# EAGLE design adc8 (EAGLE 5.06)
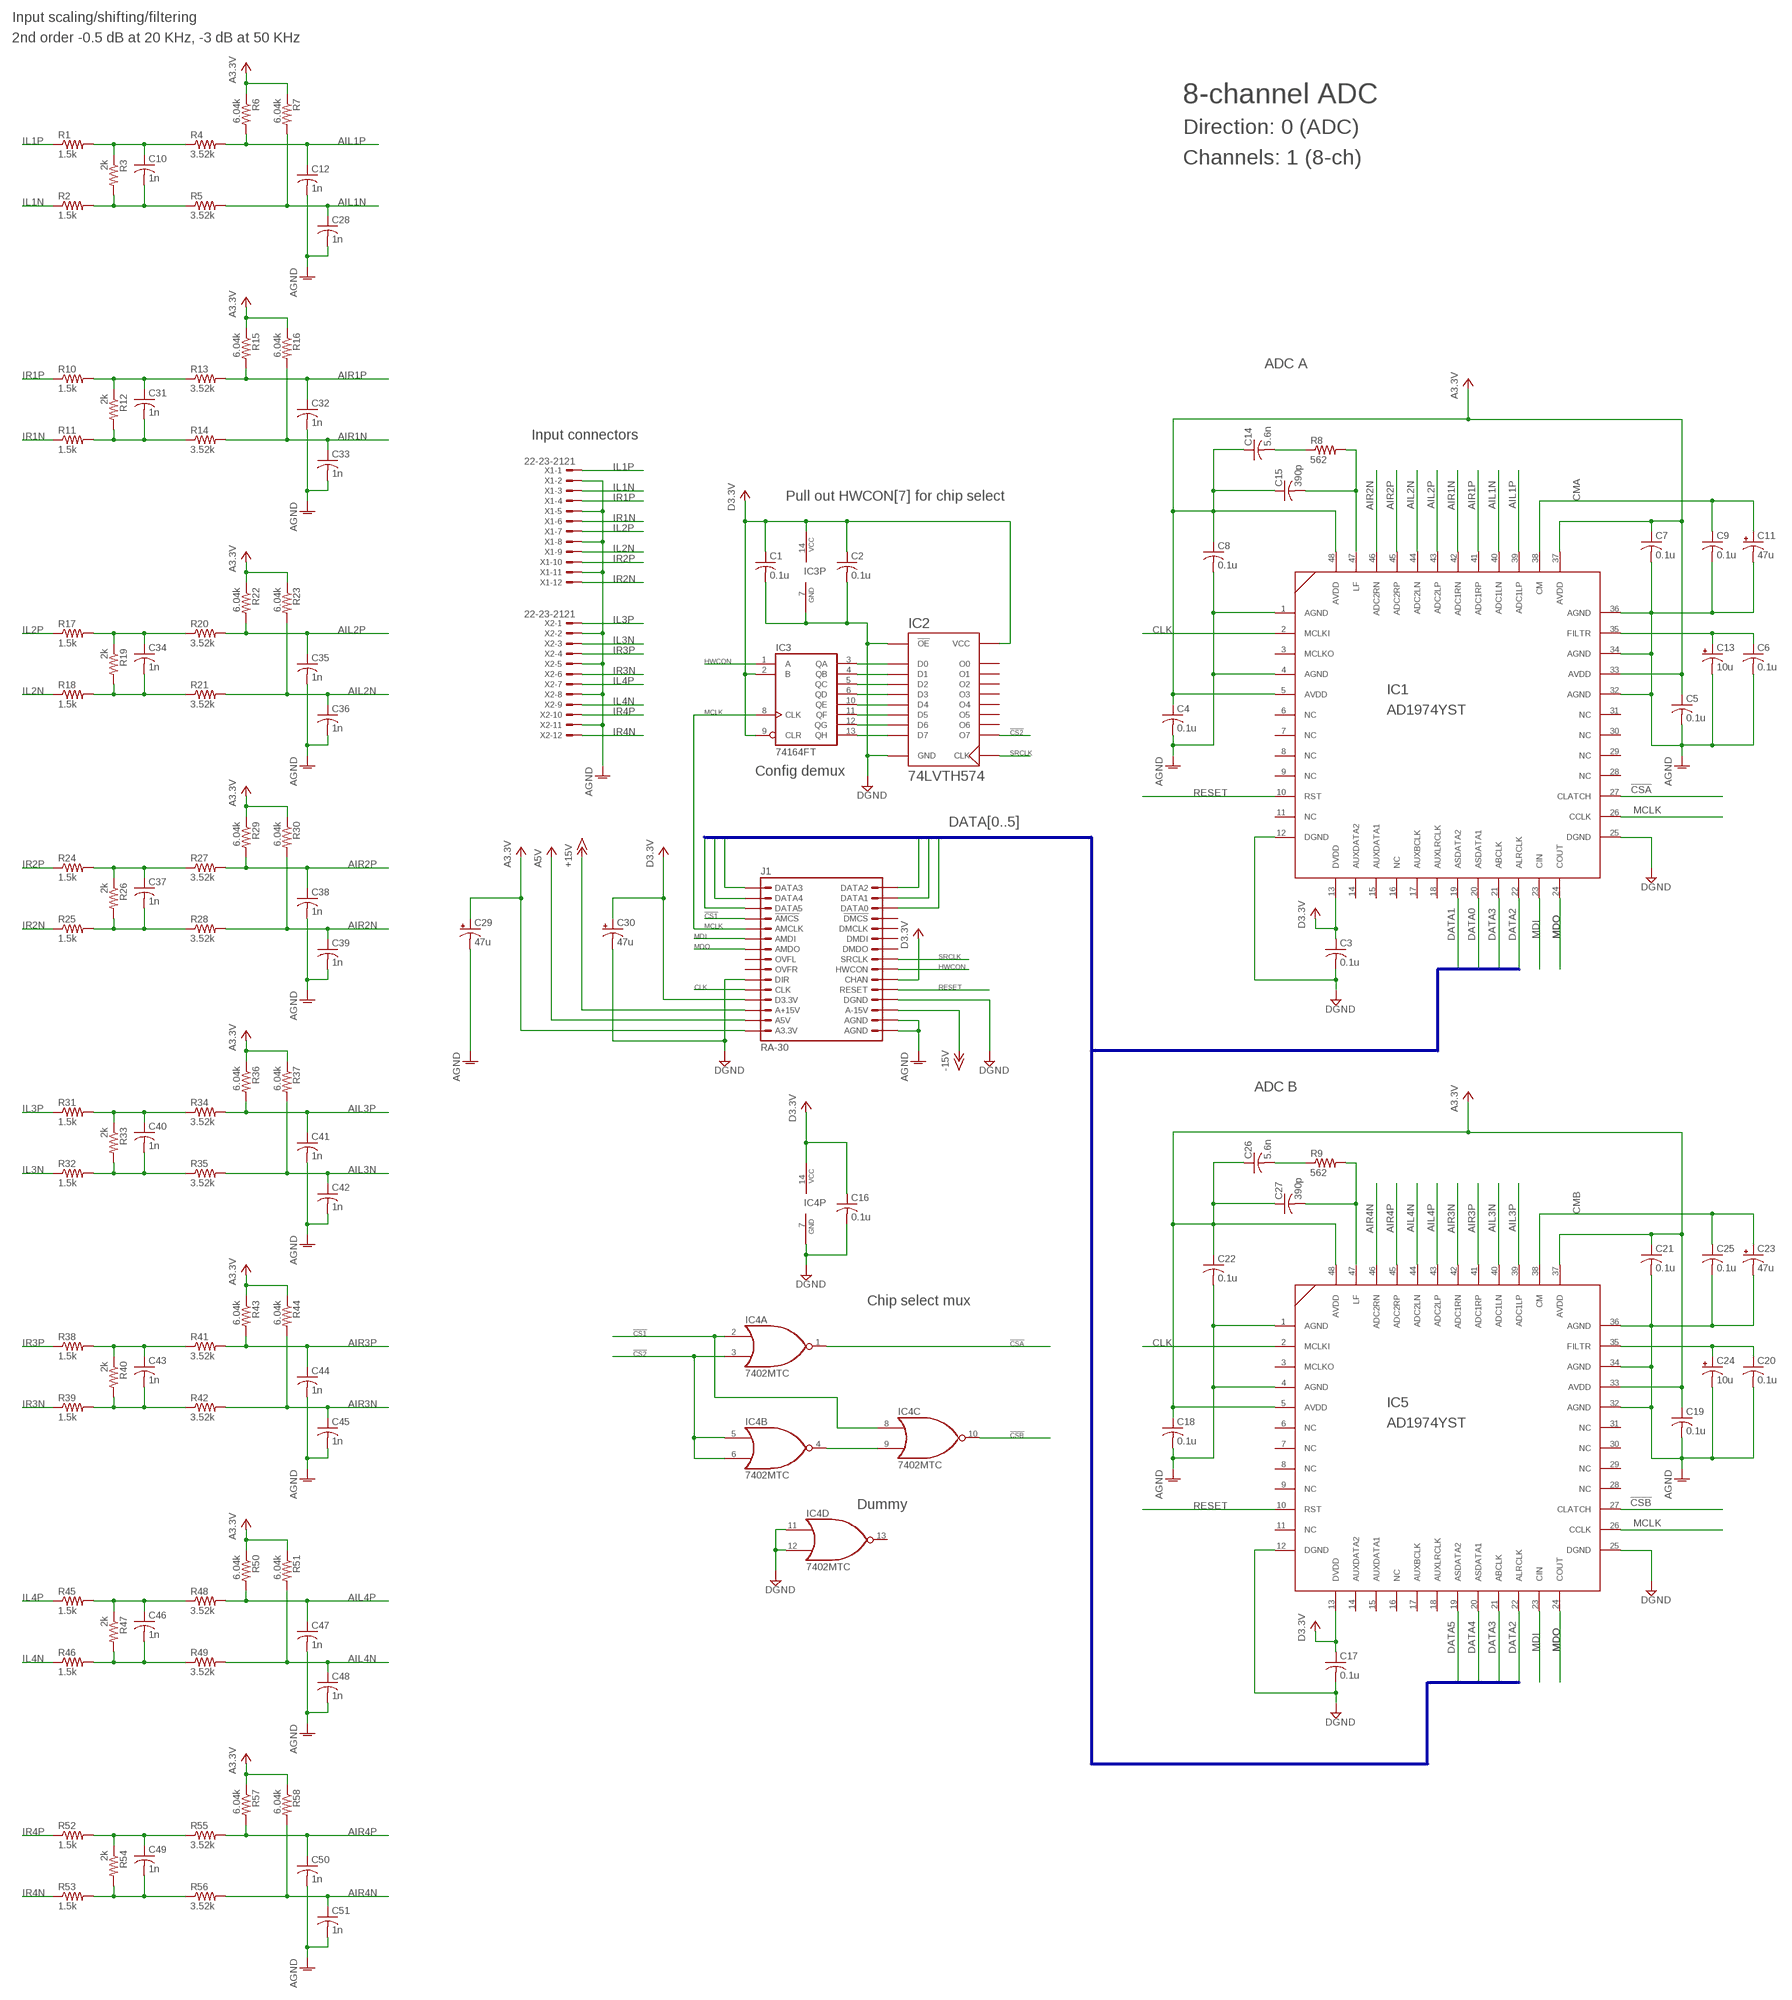
[diagram p0: schematic, sheet 1]

## Parts
C1  0.1u  C-USC1206  [C1206]
C2  0.1u  C-USC1206  [C1206]
C3  0.1u  C-USC1206  [C1206]
C4  0.1u  C-USC1206  [C1206]
C5  0.1u  C-USC1206  [C1206]
C6  0.1u  C-USC1206  [C1206]
C7  0.1u  C-USC1206  [C1206]
C8  0.1u  C-USC1206  [C1206]
C9  0.1u  C-USC1206  [C1206]
C10  1n  C-USC1206  [C1206]
C11  47u  CPOL-USB  [PANASONIC_B]
C12  1n  C-USC1206  [C1206]
C13  10u  CPOL-USA/3216-18R  [A/3216-18R]
C14  5.6n  C-USC1206  [C1206]
C15  390p  C-USC1206  [C1206]
C16  0.1u  C-USC1206  [C1206]
C17  0.1u  C-USC1206  [C1206]
C18  0.1u  C-USC1206  [C1206]
C19  0.1u  C-USC1206  [C1206]
C20  0.1u  C-USC1206  [C1206]
C21  0.1u  C-USC1206  [C1206]
C22  0.1u  C-USC1206  [C1206]
C23  47u  CPOL-USB  [PANASONIC_B]
C24  10u  CPOL-USA/3216-18R  [A/3216-18R]
C25  0.1u  C-USC1206  [C1206]
C26  5.6n  C-USC1206  [C1206]
C27  390p  C-USC1206  [C1206]
C28  1n  C-USC1206  [C1206]
C29  47u  CPOL-USB  [PANASONIC_B]
C30  47u  CPOL-USB  [PANASONIC_B]
C31  1n  C-USC1206  [C1206]
C32  1n  C-USC1206  [C1206]
C33  1n  C-USC1206  [C1206]
C34  1n  C-USC1206  [C1206]
C35  1n  C-USC1206  [C1206]
C36  1n  C-USC1206  [C1206]
C37  1n  C-USC1206  [C1206]
C38  1n  C-USC1206  [C1206]
C39  1n  C-USC1206  [C1206]
C40  1n  C-USC1206  [C1206]
C41  1n  C-USC1206  [C1206]
C42  1n  C-USC1206  [C1206]
C43  1n  C-USC1206  [C1206]
C44  1n  C-USC1206  [C1206]
C45  1n  C-USC1206  [C1206]
C46  1n  C-USC1206  [C1206]
C47  1n  C-USC1206  [C1206]
C48  1n  C-USC1206  [C1206]
C49  1n  C-USC1206  [C1206]
C50  1n  C-USC1206  [C1206]
C51  1n  C-USC1206  [C1206]
IC1  AD1974YST  [LQFP48]
IC2  74LVTH574  [TSSOP20]
IC3  74164FT  [TSSOP14]
IC4  7402MTC  [TSSOP14]
IC5  AD1974YST  [LQFP48]
J1  RA-30  [FCI-RA-30]
R1  1.5k  R-US_R1206  [R1206]
R2  1.5k  R-US_R1206  [R1206]
R3  2k  R-US_R1206  [R1206]
R4  3.52k  R-US_R1206  [R1206]
R5  3.52k  R-US_R1206  [R1206]
R6  6.04k  R-US_R1206  [R1206]
R7  6.04k  R-US_R1206  [R1206]
R8  562  R-US_R1206  [R1206]
R9  562  R-US_R1206  [R1206]
R10  1.5k  R-US_R1206  [R1206]
R11  1.5k  R-US_R1206  [R1206]
R12  2k  R-US_R1206  [R1206]
R13  3.52k  R-US_R1206  [R1206]
R14  3.52k  R-US_R1206  [R1206]
R15  6.04k  R-US_R1206  [R1206]
R16  6.04k  R-US_R1206  [R1206]
R17  1.5k  R-US_R1206  [R1206]
R18  1.5k  R-US_R1206  [R1206]
R19  2k  R-US_R1206  [R1206]
R20  3.52k  R-US_R1206  [R1206]
R21  3.52k  R-US_R1206  [R1206]
R22  6.04k  R-US_R1206  [R1206]
R23  6.04k  R-US_R1206  [R1206]
R24  1.5k  R-US_R1206  [R1206]
R25  1.5k  R-US_R1206  [R1206]
R26  2k  R-US_R1206  [R1206]
R27  3.52k  R-US_R1206  [R1206]
R28  3.52k  R-US_R1206  [R1206]
R29  6.04k  R-US_R1206  [R1206]
R30  6.04k  R-US_R1206  [R1206]
R31  1.5k  R-US_R1206  [R1206]
R32  1.5k  R-US_R1206  [R1206]
R33  2k  R-US_R1206  [R1206]
R34  3.52k  R-US_R1206  [R1206]
R35  3.52k  R-US_R1206  [R1206]
R36  6.04k  R-US_R1206  [R1206]
R37  6.04k  R-US_R1206  [R1206]
R38  1.5k  R-US_R1206  [R1206]
R39  1.5k  R-US_R1206  [R1206]
R40  2k  R-US_R1206  [R1206]
R41  3.52k  R-US_R1206  [R1206]
R42  3.52k  R-US_R1206  [R1206]
R43  6.04k  R-US_R1206  [R1206]
R44  6.04k  R-US_R1206  [R1206]
R45  1.5k  R-US_R1206  [R1206]
R46  1.5k  R-US_R1206  [R1206]
R47  2k  R-US_R1206  [R1206]
R48  3.52k  R-US_R1206  [R1206]
R49  3.52k  R-US_R1206  [R1206]
R50  6.04k  R-US_R1206  [R1206]
R51  6.04k  R-US_R1206  [R1206]
R52  1.5k  R-US_R1206  [R1206]
R53  1.5k  R-US_R1206  [R1206]
R54  2k  R-US_R1206  [R1206]
R55  3.52k  R-US_R1206  [R1206]
R56  3.52k  R-US_R1206  [R1206]
R57  6.04k  R-US_R1206  [R1206]
R58  6.04k  R-US_R1206  [R1206]
X1  22-23-2121  [22-23-2121]
X2  22-23-2121  [22-23-2121]

## Nets
!CS1: IC4.2(A:I0) IC4.8(C:I0) J1.P$A19(!AMCS)
!CS2: IC2.12(O7) IC4.3(A:I1) IC4.5(B:I0) IC4.6(B:I1)
!CSA: IC1.27(CLATCH) IC4.1(A:O)
!CSB: IC4.10(C:O) IC5.27(CLATCH)
+15V: J1.P$A28(A+15V)
-15V: J1.P$A3(A-15V)
A3.3V: C4.1 C5.1 C7.1 C8.1 C14.1 C15.1 C18.1 C19.1 C21.1 C22.1 C26.1 C27.1 C29.+ IC1.5(AVDD) IC1.33(AVDD) IC1.37(AVDD) IC1.48(AVDD) IC5.5(AVDD) IC5.33(AVDD) IC5.37(AVDD) IC5.48(AVDD) J1.P$A30(A3.3V) R6.1 R7.1 R15.1 R16.1 R22.1 R23.1 R29.1 R30.1 R36.1 R37.1 R43.1 R44.1 R50.1 R51.1 R57.1 R58.1
A5V: J1.P$A29(A5V)
AGND: C4.2 C5.2 C6.2 C7.2 C8.2 C9.2 C11.- C12.2 C13.- C18.2 C19.2 C20.2 C21.2 C22.2 C23.- C24.- C25.2 C28.2 C29.- C32.2 C33.2 C35.2 C36.2 C38.2 C39.2 C41.2 C42.2 C44.2 C45.2 C47.2 C48.2 C50.2 C51.2 IC1.1(AGND) IC1.4(AGND) IC1.32(AGND) IC1.34(AGND) IC1.36(AGND) IC5.1(AGND) IC5.4(AGND) IC5.32(AGND) IC5.34(AGND) IC5.36(AGND) J1.P$A1(AGND) J1.P$A2(AGND) X1.2 X1.5 X1.8 X1.11 X2.2 X2.5 X2.8 X2.11
AIL1N: C28.1 IC1.40(ADC1LN) R5.2 R7.2
AIL1P: C12.1 IC1.39(ADC1LP) R4.2 R6.2
AIL2N: C36.1 IC1.44(ADC2LN) R21.2 R23.2
AIL2P: C35.1 IC1.43(ADC2LP) R20.2 R22.2
AIL3N: C42.1 IC5.40(ADC1LN) R35.2 R37.2
AIL3P: C41.1 IC5.39(ADC1LP) R34.2 R36.2
AIL4N: C48.1 IC5.44(ADC2LN) R49.2 R51.2
AIL4P: C47.1 IC5.43(ADC2LP) R48.2 R50.2
AIR1N: C33.1 IC1.42(ADC1RN) R14.2 R16.2
AIR1P: C32.1 IC1.41(ADC1RP) R13.2 R15.2
AIR2N: C39.1 IC1.46(ADC2RN) R28.2 R30.2
AIR2P: C38.1 IC1.45(ADC2RP) R27.2 R29.2
AIR3N: C45.1 IC5.42(ADC1RN) R42.2 R44.2
AIR3P: C44.1 IC5.41(ADC1RP) R41.2 R43.2
AIR4N: C51.1 IC5.46(ADC2RN) R56.2 R58.2
AIR4P: C50.1 IC5.45(ADC2RP) R55.2 R57.2
CLK: IC1.2(MCLKI) IC5.2(MCLKI) J1.P$A26(CLK)
CMA: C9.1 C11.+ IC1.38(CM)
CMB: C23.+ C25.1 IC5.38(CM)
D3.3V: C1.1 C2.1 C3.1 C16.1 C17.1 C30.+ IC1.13(DVDD) IC2.20(VCC) IC3.2(B) IC3.9(CLR) IC3.14(VCC) IC4.14(P:VCC) IC5.13(DVDD) J1.P$A6(CHAN) J1.P$A27(D3.3V)
DATA0: IC1.20(ASDATA1) J1.P$A13(DATA0)
DATA1: IC1.19(ASDATA2) J1.P$A14(DATA1)
DATA2: IC1.22(ALRCLK) IC5.22(ALRCLK) J1.P$A15(DATA2)
DATA3: IC1.21(ABCLK) IC5.21(ABCLK) J1.P$A16(DATA3)
DATA4: IC5.20(ASDATA1) J1.P$A17(DATA4)
DATA5: IC5.19(ASDATA2) J1.P$A18(DATA5)
DGND: C1.2 C2.2 C3.2 C16.2 C17.2 C30.- IC1.12(DGND) IC1.25(DGND) IC2.1(!OE) IC2.10(GND) IC3.7(GND) IC4.7(P:GND) IC4.11(D:I0) IC4.12(D:I1) IC5.12(DGND) IC5.25(DGND) J1.P$A4(DGND) J1.P$A25(DIR)
HWCON: IC3.1(A) J1.P$A7(HWCON)
IL1N: R2.1 X1.3
IL1P: R1.1 X1.1
IL2N: R18.1 X1.9
IL2P: R17.1 X1.7
IL3N: R32.1 X2.3
IL3P: R31.1 X2.1
IL4N: R46.1 X2.9
IL4P: R45.1 X2.7
IR1N: R11.1 X1.6
IR1P: R10.1 X1.4
IR2N: R25.1 X1.12
IR2P: R24.1 X1.10
IR3N: R39.1 X2.6
IR3P: R38.1 X2.4
IR4N: R53.1 X2.12
IR4P: R52.1 X2.10
MCLK: IC1.26(CCLK) IC3.8(CLK) IC5.26(CCLK) J1.P$A20(AMCLK)
MDI: IC1.23(CIN) IC5.23(CIN) J1.P$A21(AMDI)
MDO: IC1.24(COUT) IC5.24(COUT) J1.P$A22(AMDO)
N$1: IC2.2(D0) IC3.3(QA)
N$2: IC2.3(D1) IC3.4(QB)
N$3: IC2.4(D2) IC3.5(QC)
N$4: IC2.5(D3) IC3.6(QD)
N$5: IC2.6(D4) IC3.10(QE)
N$6: IC2.7(D5) IC3.11(QF)
N$7: IC2.8(D6) IC3.12(QG)
N$9: IC2.9(D7) IC3.13(QH)
N$10: C20.1 C24.+ IC5.35(FILTR)
N$11: C27.2 IC5.47(LF) R9.2
N$12: IC4.4(B:O) IC4.9(C:I1)
N$13: C26.2 R9.1
N$15: C31.2 R11.2 R12.2 R14.1
N$16: C31.1 R10.2 R12.1 R13.1
N$17: C6.1 C13.+ IC1.35(FILTR)
N$20: C15.2 IC1.47(LF) R8.2
N$23: C10.2 R2.2 R3.2 R5.1
N$24: C10.1 R1.2 R3.1 R4.1
N$29: C14.2 R8.1
N$30: C34.2 R18.2 R19.2 R21.1
N$31: C34.1 R17.2 R19.1 R20.1
N$36: C37.2 R25.2 R26.2 R28.1
N$37: C37.1 R24.2 R26.1 R27.1
N$42: C40.2 R32.2 R33.2 R35.1
N$43: C40.1 R31.2 R33.1 R34.1
N$48: C43.2 R39.2 R40.2 R42.1
N$49: C43.1 R38.2 R40.1 R41.1
N$54: C46.2 R46.2 R47.2 R49.1
N$55: C46.1 R45.2 R47.1 R48.1
N$60: C49.2 R53.2 R54.2 R56.1
N$61: C49.1 R52.2 R54.1 R55.1
RESET: IC1.10(RST) IC5.10(RST) J1.P$A5(RESET)
SRCLK: IC2.11(CLK) J1.P$A8(SRCLK)
Unconnected: IC1.3(MCLKO) IC1.6(NC) IC1.7(NC) IC1.8(NC) IC1.9(NC) IC1.11(NC) IC1.14(AUXDATA2) IC1.15(AUXDATA1) IC1.16(NC) IC1.17(AUXBCLK) IC1.18(AUXLRCLK) IC1.28(NC) IC1.29(NC) IC1.30(NC) IC1.31(NC) IC2.13(O6) IC2.14(O5) IC2.15(O4) IC2.16(O3) IC2.17(O2) IC2.18(O1) IC2.19(O0) IC4.13(D:O) IC5.3(MCLKO) IC5.6(NC) IC5.7(NC) IC5.8(NC) IC5.9(NC) IC5.11(NC) IC5.14(AUXDATA2) IC5.15(AUXDATA1) IC5.16(NC) IC5.17(AUXBCLK) IC5.18(AUXLRCLK) IC5.28(NC) IC5.29(NC) IC5.30(NC) IC5.31(NC) J1.P$A9(DMDO) J1.P$A10(DMDI) J1.P$A11(DMCLK) J1.P$A12(!DMCS) J1.P$A23(OVFL) J1.P$A24(OVFR)

## Buses
DATA[0..5]

## Notes on the sheet
- Input scaling/shifting/filtering
- 2nd order -0.5 dB at 20 KHz, -3 dB at 50 KHz
- 8-channel ADC
- Direction: 0 (ADC)
- Channels: 1 (8-ch)
- ADC A
- Input connectors
- Pull out HWCON[7] for chip select
- Config demux
- ADC B
- Chip select mux
- Dummy

## Library data of the parts
C1-C10 C12 C14-C22 C25-C28 C31-C51 = rcl:C-US: CAPACITOR, American symbol
C11 C13 C23 C24 C29 C30 = rcl:CPOL-US: POLARIZED CAPACITOR, American symbol
IC1 IC5 = cdp:AD1974
IC2 = cdp:74LVTH574
IC3 = cdp:74*164: 8-bit parallel out SHIFT REGISTER
IC4 = cdp:74*02: Quad 2-input NOR gate
J1 = cdp:RA-30
R1-R58 = rcl:R-US_: RESISTOR, American symbol
X1 X2 = con-molex:22-23-2121: .100" (2.54mm) Center Header - 12 Pin

## Board
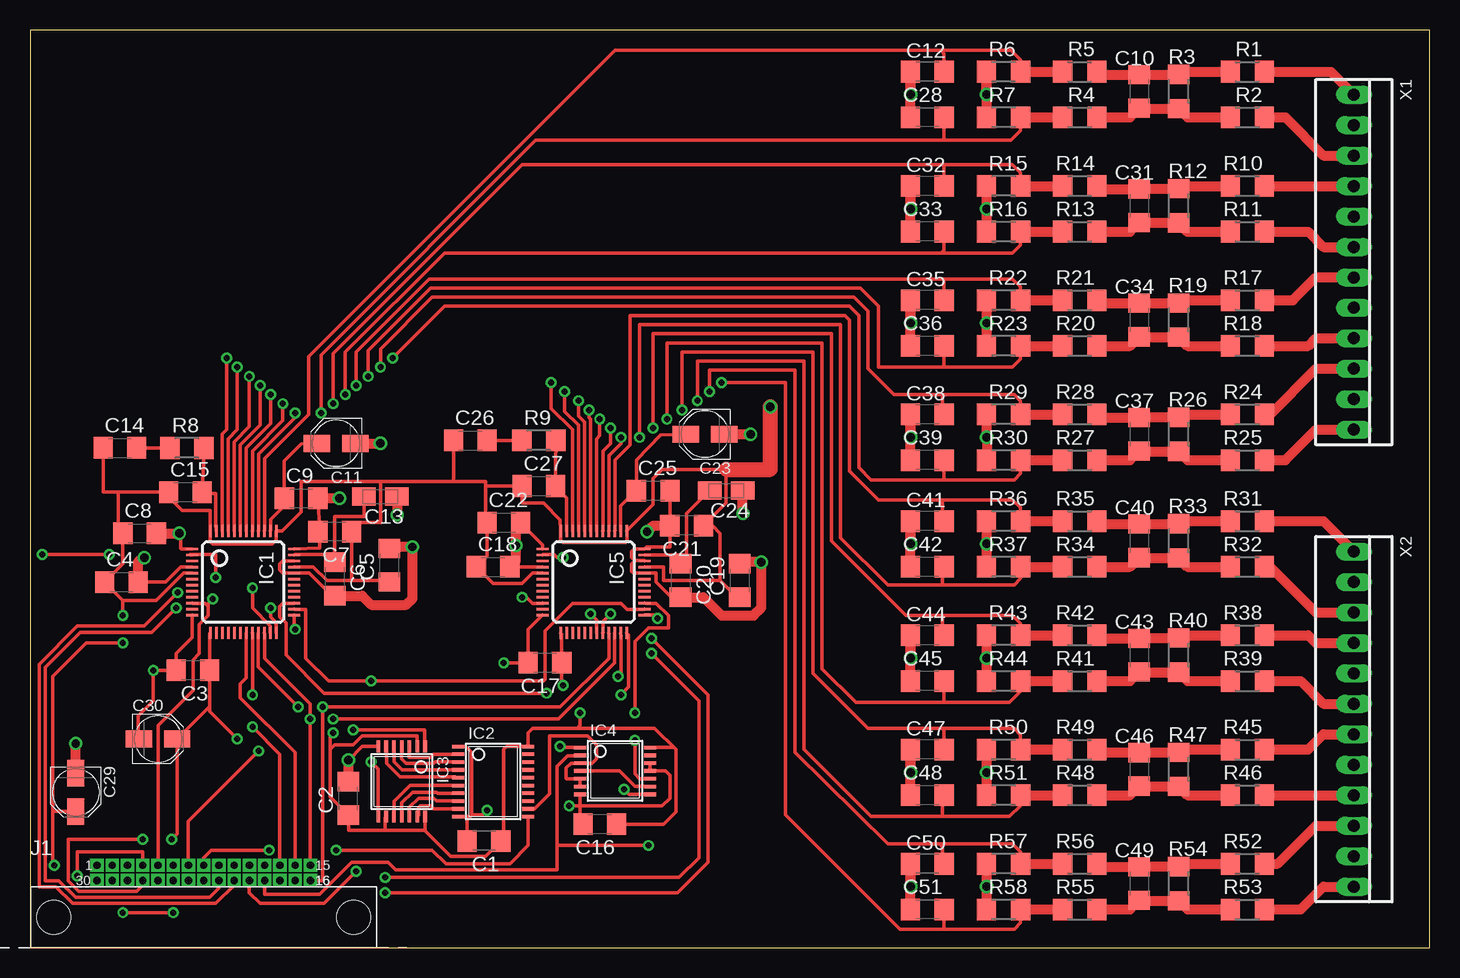
[diagram p1: board, top side]
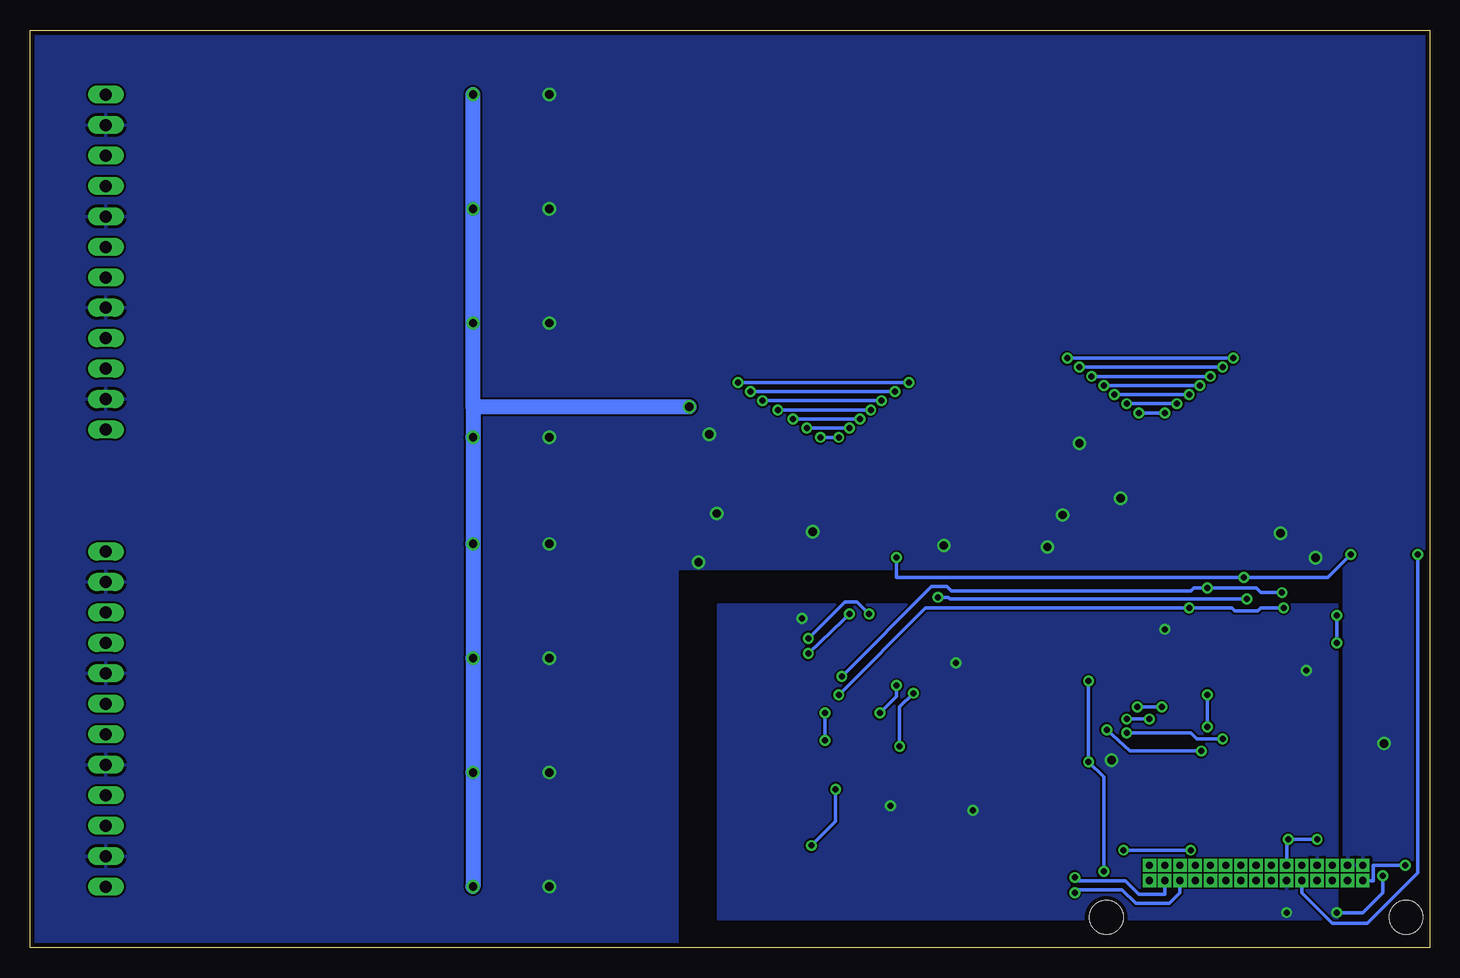
[diagram p2: board, bottom side, seen from below]

Size 116.69 x 76.5 mm. Coordinates in mm from the lower left corner, seen from the top.
Outline: 0,0 116.69,0 116.69,76.5 0,76.5 0,0
Copper layers (1*16): Top 0.035mm / dielectric 1.5mm / Bottom 0.035mm
Design rules "6mils *": minimum track width 7mil, minimum drill 15mil, track to track 6mil, track to pad 6mil, pad to pad 6mil, via to via 6mil, smd to smd 6mil, copper to edge 15mil, drill to drill 8mil, minimum pad ring 10mil, minimum via ring 8mil, stop-mask expansion 4mil, vias tented up to drill 0mil, thermal gap 10mil

### Footprints (pad centres in the part's own frame; a part is rotated, then mirrored left to right if it is on the bottom)
C1206 = smd 1.6 x 1.8: 1 -1.4,0; 2 1.4,0
PANASONIC_B = smd 2.2 x 1.4: + 1.6,0; - -1.6,0
A/3216-18R = smd 1.95 x 1.5: + 1.375,0; - -1.375,0
LQFP48 = smd 0.2 x 1: 1 -2.75,-4.25; 2 -2.25,-4.25; 3 -1.75,-4.25; 4 -1.25,-4.25; 5 -0.75,-4.25; 6 -0.25,-4.25; 7 0.25,-4.25; 8 0.75,-4.25; 9 1.25,-4.25; 10 1.75,-4.25; 11 2.25,-4.25; 12 2.75,-4.25; 25 2.75,4.25; 26 2.25,4.25; 27 1.75,4.25; 28 1.25,4.25; 29 0.75,4.25; 30 0.25,4.25; 31 -0.25,4.25; 32 -0.75,4.25; 33 -1.25,4.25; 34 -1.75,4.25; 35 -2.25,4.25; 36 -2.75,4.25 | smd 1 x 0.2: 13 4.25,-2.75; 14 4.25,-2.25; 15 4.25,-1.75; 16 4.25,-1.25; 17 4.25,-0.75; 18 4.25,-0.25; 19 4.25,0.25; 20 4.25,0.75; 21 4.25,1.25; 22 4.25,1.75; 23 4.25,2.25; 24 4.25,2.75; 37 -4.25,2.75; 38 -4.25,2.25; 39 -4.25,1.75; 40 -4.25,1.25; 41 -4.25,0.75; 42 -4.25,0.25; 43 -4.25,-0.25; 44 -4.25,-0.75; 45 -4.25,-1.25; 46 -4.25,-1.75; 47 -4.25,-2.25; 48 -4.25,-2.75
TSSOP20 = smd 0.305 x 0.991: 1 -2.925,-2.918; 2 -2.275,-2.918; 3 -1.625,-2.918; 4 -0.975,-2.918; 5 -0.325,-2.918; 6 0.325,-2.918; 7 0.975,-2.918; 8 1.625,-2.918; 9 2.275,-2.918; 10 2.925,-2.918; 11 2.925,2.918; 12 2.275,2.918; 13 1.625,2.918; 14 0.975,2.918; 15 0.325,2.918; 16 -0.325,2.918; 17 -0.975,2.918; 18 -1.625,2.918; 19 -2.275,2.918; 20 -2.925,2.918
TSSOP14 = smd 0.305 x 0.991: 1 -1.95,-2.918; 2 -1.3,-2.918; 3 -0.65,-2.918; 4 0,-2.918; 5 0.65,-2.918; 6 1.3,-2.918; 7 1.95,-2.918; 8 1.95,2.918; 9 1.3,2.918; 10 0.65,2.918; 11 0,2.918; 12 -0.65,2.918; 13 -1.3,2.918; 14 -1.95,2.918
FCI-RA-30 = drill 0.6 pad 0.813 square: P$A1 -8.89,0.635; P$A2 -7.62,0.635; P$A3 -6.35,0.635; P$A4 -5.08,0.635; P$A5 -3.81,0.635; P$A6 -2.54,0.635; P$A7 -1.27,0.635; P$A8 0,0.635; P$A9 1.27,0.635; P$A10 2.54,0.635; P$A11 3.81,0.635; P$A12 5.08,0.635; P$A13 6.35,0.635; P$A14 7.62,0.635; P$A15 8.89,0.635; P$A16 8.89,-0.635; P$A17 7.62,-0.635; P$A18 6.35,-0.635; P$A19 5.08,-0.635; P$A20 3.81,-0.635; P$A21 2.54,-0.635; P$A22 1.27,-0.635; P$A23 0,-0.635; P$A24 -1.27,-0.635; P$A25 -2.54,-0.635; P$A26 -3.81,-0.635; P$A27 -5.08,-0.635; P$A28 -6.35,-0.635; P$A29 -7.62,-0.635; P$A30 -8.89,-0.635 | hole 2.8: -12.497,-3.708; 12.497,-3.708
R1206 = smd 1.6 x 1.803: 1 -1.422,0; 2 1.422,0
22-23-2121 = drill 1 long: 1 -13.97,0; 2 -11.43,0; 3 -8.89,0; 4 -6.35,0; 5 -3.81,0; 6 -1.27,0; 7 1.27,0; 8 3.81,0; 9 6.35,0; 10 8.89,0; 11 11.43,0; 12 13.97,0

### Placement (x,y rotation side)
C1  37.85,8.89 180 top
C2  26.54,12.45 90 top
C3  13.59,23.11 180 top
C4  7.62,30.48 0 top
C5  29.97,31.88 90 top
C6  25.4,30.73 270 top
C7  25.4,34.67 180 top
C8  9.14,34.54 0 top
C9  22.61,37.47 0 top
C10  92.46,71.37 270 top
C11  25.53,42.04 180 top
C12  74.8,73.03 180 top
C13  29.21,37.59 180 top
C14  7.49,41.66 0 top
C15  12.95,37.97 0 top
C16  47.5,10.29 180 top
C17  42.93,23.75 180 top
C18  38.61,31.75 0 top
C19  59.18,30.61 90 top
C20  54.23,30.61 270 top
C21  54.74,35.18 180 top
C22  39.5,35.43 0 top
C23  56.26,42.8 180 top
C24  58.04,38.1 180 top
C25  51.94,38.1 0 top
C26  36.7,42.29 0 top
C27  42.42,38.48 0 top
C28  74.8,69.22 180 top
C29  3.81,12.95 270 top
C30  10.67,17.4 0 top
C31  92.46,61.85 270 top
C32  74.8,63.5 180 top
C33  74.8,59.69 180 top
C34  92.46,52.32 270 top
C35  74.8,53.98 180 top
C36  74.8,50.16 180 top
C37  92.46,42.8 270 top
C38  74.8,44.45 180 top
C39  74.8,40.64 180 top
C40  92.46,33.91 270 top
C41  74.8,35.56 180 top
C42  74.8,31.75 180 top
C43  92.46,24.38 270 top
C44  74.8,26.04 180 top
C45  74.8,22.23 180 top
C46  92.46,14.86 270 top
C47  74.8,16.51 180 top
C48  74.8,12.7 180 top
C49  92.46,5.33 270 top
C50  74.8,6.99 180 top
C51  74.8,3.17 180 top
IC1  17.78,30.48 270 top
IC2  38.61,13.84 270 top
IC3  30.99,13.84 180 top
IC4  48.77,14.73 270 top
IC5  46.99,30.48 270 top
J1  14.48,6.22 0 top
R1  101.47,73.03 180 top
R2  101.47,69.22 180 top
R3  95.76,71.37 270 top
R4  87.5,73.03 180 top
R5  87.5,69.22 180 top
R6  81.15,73.03 0 top
R7  81.15,69.22 0 top
R8  13.08,41.66 0 top
R9  42.42,42.29 0 top
R10  101.47,63.5 180 top
R11  101.47,59.69 180 top
R12  95.76,61.85 270 top
R13  87.5,63.5 180 top
R14  87.5,59.69 180 top
R15  81.15,63.5 0 top
R16  81.15,59.69 0 top
R17  101.47,53.98 180 top
R18  101.47,50.16 180 top
R19  95.76,52.32 270 top
R20  87.5,53.98 180 top
R21  87.5,50.16 180 top
R22  81.15,53.98 0 top
R23  81.15,50.16 0 top
R24  101.47,44.45 180 top
R25  101.47,40.64 180 top
R26  95.76,42.8 270 top
R27  87.5,44.45 180 top
R28  87.5,40.64 180 top
R29  81.15,44.45 0 top
R30  81.15,40.64 0 top
R31  101.47,35.56 180 top
R32  101.47,31.75 180 top
R33  95.76,33.91 270 top
R34  87.5,35.56 180 top
R35  87.5,31.75 180 top
R36  81.15,35.56 0 top
R37  81.15,31.75 0 top
R38  101.47,26.04 180 top
R39  101.47,22.23 180 top
R40  95.76,24.38 270 top
R41  87.5,26.04 180 top
R42  87.5,22.23 180 top
R43  81.15,26.04 0 top
R44  81.15,22.23 0 top
R45  101.47,16.51 180 top
R46  101.47,12.7 180 top
R47  95.76,14.86 270 top
R48  87.5,16.51 180 top
R49  87.5,12.7 180 top
R50  81.15,16.51 0 top
R51  81.15,12.7 0 top
R52  101.47,6.99 180 top
R53  101.47,3.17 180 top
R54  95.76,5.33 270 top
R55  87.5,6.99 180 top
R56  87.5,3.17 180 top
R57  81.15,6.99 0 top
R58  81.15,3.17 0 top
X1  110.36,57.15 270 top
X2  110.36,19.05 270 top

### Tracks (layer width: path | path; a pad name or v marks a point on that pad's centre or on a via)
!CS1  (via drill 0.5)
  Top 0.305: J1.P$A19 19.56,4.45 24.13,4.45 26.8,7.11 29.84,7.11 30.48,6.48 43.94,6.48 43.94,8.51 | 43.94,8.51 43.94,15.11 44.83,16 45.82,16 IC4.2 | 43.94,8.51 v51.56,8.51 | IC4.8 49.96,12.78 v49.53,13.21
  Bottom 0.305: v49.53,13.21 49.53,10.54 v51.56,8.51
!CS2
  Top 0.305: IC4.6 IC4.5 44.72,14.08 44.7,14.1 44.7,14.99 45.09,15.37 45.84,15.37 IC4.3 45.87,15.37 46.86,15.37 47.24,15.75 47.24,16.89 46.48,17.65 43.31,17.65 43.31,12.83 42.05,11.57 IC2.12
!CSA  (via drill 0.5)
  Top 0.305: IC4.1 44.28,16.68 v44.2,16.76 | v43.05,21.21 24.51,21.21 21.34,24.38 21.34,27.05 20.83,27.56 20.83,28.45 21.08,28.7 22,28.7 IC1.27
  Bottom 0.305: v44.2,16.76 44.2,20.07 v43.05,21.21
!CSB  (via drill 0.5)
  Top 0.305: IC4.10 50.81,14.08 50.42,14.48 v50.42,17.27 | v50.42,19.56 50.42,25.53 51.56,26.67 53.21,26.67 53.21,27.69 52.2,28.7 51.34,28.7 IC5.27
  Bottom 0.305: v50.42,17.27 v50.42,19.56
A3.3V  (via drill 0.5, 0.7)
  Top 0.305: C14.1 6.09,37.97 7.37,37.97 | 11.18,37.97 C15.1 | 7.37,37.97 11.18,37.97 | 11.18,37.97 12.7,36.45 15.03,36.45 IC1.48 15.03,33.95 14.99,33.91 15.24,33.66 20.19,33.66 20.53,33.99 IC1.37 21.01,34.73 22.61,36.32 22.61,38.73 22.73,38.86 | 37.97,38.48 37.97,35.56 C22.1 38.1,32.64 C18.1 38.6,30.35 41.02,30.35 41.9,31.23 IC5.5 | 35.3,38.86 37.97,38.86 37.97,38.48 | 35.3,38.86 C26.1 | 37.97,38.48 C27.1 41.02,37.08 42.8,37.08 44.19,35.67 IC5.48 44.24,33.99 44.45,33.78 49.66,33.78 49.78,33.91 49.78,34.69 IC5.37 51.94,36.93 51.94,39.12 52.7,39.88 58.04,39.88 58.04,37.08 C21.1 56.9,35.18 57.53,34.54 57.53,30.61 | 24.77,30.61 23.62,31.75 22.05,31.75 IC1.33 | 26.93,34.54 C7.1 26.92,34.67 26.92,35.43 29.21,35.43 29.21,38.86 | IC5.33 51.26,31.75 52.83,31.75 52.83,30.61 57.53,30.61 | IC1.5 12.81,31.23 10.54,28.96 7.74,28.96 | 7.74,28.96 C4.1 7.74,32 C8.1 7.49,34.8 7.37,34.8 7.37,37.97 | 22.73,38.86 27.94,38.86 | 22.73,38.86 22.61,38.86 | 27.94,38.86 27.81,38.86 | 27.94,38.86 29.21,38.86 | 29.21,38.86 35.3,38.86 | 7.74,28.96 v7.74,27.69 v7.75,27.69 | v7.75,25.4 4.7,25.4 1.91,22.61 1.91,11.43 | 1.91,11.43 1.91,6.99 v2.03,6.86 | C29.+ 1.98,11.35 1.91,11.43 | 24.77,30.61 29.84,30.61 C5.1 | 26.8,34.8 C7.1 26.8,30.73 26.67,30.61 24.77,30.61 | C19.1 58.93,29.21 57.53,30.61
  Top 0.813: C7.1 | R7.1 R6.1 79.73,71.14 v79.76,71.12 | R16.1 R15.1 79.76,63.48 v79.76,61.59 | R23.1 R22.1 79.76,53.95 v79.76,52.07 | R29.1 79.73,44.35 79.76,44.32 v79.76,42.55 79.76,40.66 R30.1 | R58.1 R57.1 79.76,6.96 v79.76,5.08 | R51.1 R50.1 79.76,16.48 v79.76,14.61 | 79.73,25.53 R44.1 | 79.73,25.53 R43.1 | R37.1 R36.1 79.76,35.53 v79.76,33.66 | v79.76,24.13 79.76,25.5 79.73,25.53
  Top 1.27: 58.04,39.88 61.72,39.88 v61.72,45.09
  Bottom 0.305: v7.75,25.4 v7.75,27.69 | v2.03,6.86 4.7,6.86 4.7,5.59 J1.P$A30
  Bottom 1.27: v79.76,5.08 v79.76,14.61 v79.76,24.13 v79.76,33.66 v79.76,42.55 79.76,45.09 | 79.76,45.09 v79.76,52.07 v79.76,61.59 v79.76,71.12 | v61.72,45.09 79.76,45.09
AGND  (via drill 0.7)
  Top 0.305: C8.2 12.22,34.54 12.57,34.19 12.57,33.27 12.62,33.23 IC1.1 | C4.2 11.3,30.48 12.57,31.75 13.51,31.75 IC1.4 | C6.2 25.15,29.33 24.38,30.1 23.25,31.23 IC1.32 22.02,31.24 21.08,31.24 20.83,31.5 20.83,32 21.05,32.23 IC1.34 | 50.42,32.26 50.16,32 50.16,31.37 50.3,31.23 IC5.32 51.19,31.23 51.18,31.24 52.2,31.24 52.2,30.48 53.47,29.21 C20.2 | 50.42,32.26 51.21,32.26 IC5.34 | 50.42,32.26 50.16,32.51 50.16,33.02 50.38,33.23 IC5.36 51.41,33.4 53.34,33.4 | IC5.1 42.74,33.59 40.51,35.81 40.52,35.81 C22.2 | C18.2 42.72,31.75 IC5.4 | 53.34,33.4 | 53.34,33.4 C21.2 C25.2 | 24.13,34.67 24.13,33.3 IC1.36 | 24.13,34.67 C9.2 | 24.13,34.67 C7.2
  Top 0.813: C29.- v3.81,17.02 | C4.2 9.02,32.13 9.46,32.58 | 9.46,32.58 9.53,32.64 | v12.45,34.54 C8.2 | 9.46,32.58 v9.53,32.51 | C11.- v29.21,42.04 | C9.2 v25.78,37.47 | C13.- 30.59,36.09 v30.61,36.07 | 40.52,32.51 40.52,35.81 | 40.52,32.51 40.52,32.26 40.07,31.81 | 40.07,31.81 C18.2 | v40.51,33.53 40.51,32.52 40.52,32.51 | C23.- v60.07,42.8 | C21.2 51.94,35.18 v51.44,34.67 | C18.2 40.07,31.81 | C6.2 27.69,29.33 28.45,28.57 31.37,28.57 31.88,29.08 v31.88,33.4 30.1,33.4 C5.2 | C20.2 56.13,29.21 57.66,27.69 60.33,27.69 60.96,28.32 v60.96,32.13 59.31,32.13 C19.2 | C24.- 59.41,36.22 v59.44,36.2 | C28.2 C12.2 v73.41,71.12 | C33.2 C32.2 v73.41,61.59 | C36.2 C35.2 v73.41,52.07 | C39.2 C38.2 v73.41,42.55 | C45.2 C44.2 v73.41,24.13 | C42.2 C41.2 v73.41,33.66 | C51.2 C50.2 v73.41,5.08 | C48.2 C47.2 v73.41,14.61
  pour Bottom: 7.11,5.97 0.13,5.97 0.13,76.45 116.46,76.45 116.46,0.25 62.74,0.25 62.74,31.62 7.11,31.62
AIL1N  (via drill 0.5)
  Top 0.305: R7.2 82.58,68.1 81.79,67.31 76.2,67.31 | 76.2,67.31 42.16,67.31 24.26,49.4 v24.26,44.58 | C28.1 76.2,67.31 | v22.1,44.58 22.1,44.2 19.05,41.15 19.05,34.75 IC1.40
  Top 0.813: R7.2 R5.2
  Bottom 0.305: v22.1,44.58 v24.26,44.58
AIL1P
  Top 0.305: R6.2 82.58,74.02 81.79,74.8 75.95,74.8 | 75.95,74.8 48.77,74.8 23.24,49.28 23.24,44.45 19.56,40.77 19.56,34.76 IC1.39 | C12.1 76.2,74.55 75.95,74.8
  Top 0.813: R6.2 R4.2
AIL2N  (via drill 0.5)
  Top 0.305: R23.2 82.58,49.05 81.92,48.39 76.33,48.39 | 76.33,48.39 70.74,48.39 70.74,53.47 69.22,54.99 33.4,54.99 28.19,49.78 v28.19,47.62 | C36.1 76.2,48.51 76.33,48.39 | v18.29,47.62 18.29,43.43 17.02,42.16 17.02,34.74 IC1.44
  Top 0.406: C36.1 76.2,50.68
  Top 0.813: R23.2 R21.2
  Bottom 0.305: v18.29,47.62 v28.19,47.62
AIL2P  (via drill 0.5)
  Top 0.305: R22.2 82.58,55.09 81.92,55.75 76.33,55.75 | 76.33,55.75 33.27,55.75 27.18,49.66 v27.18,46.86 | C35.1 76.2,55.63 76.33,55.75 | v19.18,46.86 19.18,43.56 17.53,41.91 IC1.43
  Top 0.406: C35.1 76.07,53.85 76.07,53.59
  Top 0.813: R22.2 R20.2
  Bottom 0.305: v19.18,46.86 v27.18,46.86
AIL3N  (via drill 0.5)
  Top 0.305: R37.2 82.58,30.76 82.04,30.23 75.95,30.23 | 75.95,30.23 71.5,30.23 67.56,34.16 67.56,51.94 50.8,51.94 v50.8,42.55 | v49.28,42.55 49.28,42.04 48.26,41.02 48.26,34.75 IC5.40 | C42.1 76.2,31.87 76.07,32 76.07,30.35 75.95,30.23
  Top 0.406: C42.1 76.2,32.26
  Top 0.813: R37.2 R35.2
  Bottom 0.305: v49.28,42.55 v50.8,42.55
AIL3P
  Top 0.305: R36.2 82.58,36.68 81.92,37.34 76.07,37.34 | 76.07,37.34 70.74,37.34 68.33,39.75 68.33,52.32 67.94,52.7 50.04,52.7 50.04,41.91 48.77,40.64 48.77,34.76 IC5.39 | 76.07,37.34 76.07,35.43
  Top 0.406: C41.1 76.07,35.43 76.07,35.18
  Top 0.813: R36.2 R34.2
AIL4N  (via drill 0.5)
  Top 0.305: R51.2 82.58,11.84 81.66,10.92 76.07,10.92 | 76.07,10.92 70.1,10.92 64.52,16.51 64.52,48.9 55.63,48.9 v55.63,45.59 | v45.72,45.59 45.72,44.32 46.23,43.81 46.23,34.74 IC5.44 | C48.1 76.07,12.7 76.07,10.92
  Top 0.406: C48.1 76.2,13.21
  Top 0.813: R51.2 R49.2
  Bottom 0.305: v45.72,45.59 v55.63,45.59
AIL4P  (via drill 0.5)
  Top 0.305: R50.2 82.58,17.75 82.04,18.29 76.33,18.29 | 76.33,18.29 69.85,18.29 65.28,22.86 65.28,49.66 54.36,49.66 v54.36,44.83 | v46.61,44.83 46.61,44.2 46.74,44.07 IC5.43 | C47.1 76.2,18.16 76.33,18.29
  Top 0.406: C47.1 76.07,16.38 76.07,16.13
  Top 0.813: R50.2 R48.2
  Bottom 0.305: v46.61,44.83 v54.36,44.83
AIR1N  (via drill 0.5)
  Top 0.305: R16.2 82.58,58.57 81.92,57.91 75.95,57.91 | 75.95,57.91 34.54,57.91 26.29,49.66 v26.29,46.1 | C33.1 76.2,58.17 75.95,57.91 | v20.07,46.1 20.07,43.69 18.03,41.66 IC1.42
  Top 0.813: R16.2 R14.2
  Bottom 0.305: v20.07,46.1 v26.29,46.1
AIR1P  (via drill 0.5)
  Top 0.305: R15.2 82.58,64.62 81.92,65.28 76.07,65.28 | 76.07,65.28 41.02,65.28 25.27,49.53 v25.27,45.34 | C32.1 76.2,65.15 76.07,65.28 | v21.08,45.34 21.08,43.94 18.54,41.4 18.54,34.74 IC1.41
  Top 0.813: R15.2 R13.2
  Bottom 0.305: v21.08,45.34 v25.27,45.34
AIR2N  (via drill 0.5)
  Top 0.305: R30.2 82.58,39.52 82.04,38.99 76.07,38.99 | 76.07,38.99 70.1,38.99 69.09,40.01 69.09,52.7 68.33,53.47 34.54,53.47 v30.23,49.15 | C39.1 76.2,39.12 76.07,38.99 | v16.38,49.15 16.38,43.18 16,42.8 16,34.76 IC1.46
  Top 0.813: R30.2 R28.2
  Bottom 0.305: v16.38,49.15 v30.23,49.15
AIR2P  (via drill 0.5)
  Top 0.305: R29.2 82.58,45.57 82.04,46.1 76.2,46.1 | 76.2,46.1 72.01,46.1 69.85,48.26 69.85,53.09 68.71,54.23 33.53,54.23 29.21,49.91 v29.21,48.39 | 76.07,44.32 76.07,45.97 76.2,46.1 | v17.27,48.39 17.27,43.18 16.51,42.42 16.51,34.75 IC1.45
  Top 0.406: C38.1 76.07,44.32 76.07,44.07
  Top 0.813: R29.2 R27.2
  Bottom 0.305: v17.27,48.39 v29.21,48.39
AIR3N  (via drill 0.5)
  Top 0.305: R44.2 82.58,21.36 81.66,20.45 76.2,20.45 | 76.2,20.45 68.83,20.45 66.04,23.24 66.04,50.42 53.09,50.42 v53.09,44.07 | v47.5,44.07 47.5,42.67 47.24,42.42 IC5.42 | C45.1 76.2,20.45
  Top 0.406: C45.1 76.2,22.74
  Top 0.813: R44.2 R42.2
  Bottom 0.305: v47.5,44.07 v53.09,44.07
AIR3P  (via drill 0.5)
  Top 0.305: R43.2 82.58,27.03 81.92,27.69 75.95,27.69 | 75.95,27.69 73.03,27.69 66.8,33.91 66.8,51.18 51.94,51.18 v51.94,43.31 | v48.39,43.31 48.39,42.04 47.75,41.4 47.75,34.74 IC5.41 | 76.07,25.91 76.07,27.56 75.95,27.69
  Top 0.406: C44.1 76.07,25.91 76.07,25.65
  Top 0.813: R43.2 R41.2
  Bottom 0.305: v48.39,43.31 v51.94,43.31
AIR4N  (via drill 0.5)
  Top 0.305: R58.2 82.58,2.06 82.04,1.52 76.07,1.52 | 76.07,1.52 72.52,1.52 62.99,11.05 62.99,47.12 v57.66,47.12 | v43.43,47.12 43.43,44.96 45.21,43.18 45.21,34.76 IC5.46 | C51.1 76.2,1.65 76.07,1.52
  Top 0.813: R58.2 R56.2
  Bottom 0.305: v57.66,47.12 v43.43,47.12
AIR4P  (via drill 0.5)
  Top 0.305: R57.2 82.58,7.98 81.92,8.64 75.82,8.64 | 75.82,8.64 71.5,8.64 63.75,16.26 63.75,48.13 56.64,48.13 v56.64,46.35 | v44.58,46.35 44.58,44.7 45.72,43.56 45.72,34.75 IC5.45 | 76.07,6.86 76.07,8.38 75.82,8.64
  Top 0.406: C50.1 76.07,6.86 76.07,6.6
  Top 0.813: R57.2 R55.2
  Bottom 0.305: v44.58,46.35 v56.64,46.35
CLK  (via drill 0.5)
  Top 0.305: v1.02,32.77 v6.6,32.77 | v44.45,32.51 43.94,32.51 43.69,32.77 42.78,32.77 IC5.2 | IC1.2 13.37,32.73 13.34,32.77 15.49,32.77 v15.49,30.86
  Bottom 0.305: J1.P$A26 10.67,4.57 8.13,2.03 5.21,2.03 1.02,6.22 v1.02,32.77 | v6.6,32.77 8.51,30.86 v15.49,30.86 44.45,30.86 v44.45,32.51
CMA
  Top 0.305: C11.+ 22.6,41.98 21.21,40.59 C9.1 21.21,36.83 20.07,35.69 20.07,34.77 IC1.38
CMB
  Top 0.305: IC5.38 49.24,36.8 C25.1 50.55,40.64 52.58,42.74 C23.+
D3.3V  (via drill 0.5)
  Top 0.305: IC1.13 14.99,26.19 C3.1 14.99,20.12 | IC5.13 44.33,26.14 C17.1 44.33,21.97 v44.45,21.84 | IC4.14 53.68,16.68 53.85,16.51 | 53.85,16.51 53.85,11.3 52.83,10.29 C16.1 | 29.59,9.78 26.55,9.78 C2.1 25.02,12.57 25.02,16.51 | 29.59,9.78 29.59,10.83 IC3.9 | 32.94,9.86 IC3.14 | 32.94,9.86 32.89,9.78 29.59,9.78 | 32.94,9.86 32.94,9.73 35.05,7.62 37.98,7.62 C1.1 39.5,9.14 39.5,16.51 39.76,16.77 IC2.20 41.53,17.9 41.91,18.29 45.59,18.29 | IC3.2 32.29,17.5 32.26,17.53 32.26,17.65 27.69,17.65 26.92,16.89 25.4,16.89 25.02,16.51 | J1.P$A27 9.4,5.21 8.89,4.7 4.06,4.7 3.17,5.59 3.17,9.02 v9.4,9.02 | 45.59,18.29 52.07,18.29 53.85,16.51 | v45.85,19.56 45.85,18.54 45.59,18.29 | v11.81,9.02 12.27,9.47 C30.+ 14.99,20.12 | 25.02,16.51 25.02,17.65 v25.27,17.91 | 14.99,20.12 14.99,19.68 v17.27,17.4
  Bottom 0.305: v9.4,9.02 v11.81,9.02 11.94,8.89 J1.P$A6 | v44.45,21.84 44.45,20.95 v45.85,19.56 | v25.27,17.91 19.94,17.91 19.43,17.4 v17.27,17.4
DATA0  (via drill 0.5)
  Top 0.305: J1.P$A13 20.83,16.13 v18.54,18.41 | v18.54,21.08 18.54,26.22 IC1.20
  Bottom 0.305: v18.54,18.41 v18.54,21.08
DATA1
  Top 0.305: J1.P$A14 22.1,16.26 17.53,20.83 17.53,21.97 18.03,22.48 18.03,25.98 IC1.19
DATA2  (via drill 0.5)
  Top 0.305: J1.P$A15 v23.37,19.05 23.37,20.32 19.56,24.13 19.56,26.2 IC1.22 | IC5.22 48.74,23.72 44.07,19.05 v25.27,19.05
  Bottom 0.305: v23.37,19.05 v25.27,19.05
DATA3  (via drill 0.5)
  Top 0.305: J1.P$A16 24.38,5.59 v24.38,20.07 44.2,20.07 48.26,24.13 48.26,26.21 IC5.21 | IC1.21 19.03,23.39 v22.35,20.07
  Bottom 0.305: v24.38,20.07 v22.35,20.07
DATA4  (via drill 0.5)
  Top 0.305: v48.39,27.81 47.75,27.18 47.75,26.24 IC5.20 | v29.59,5.84 54.1,5.84 55.75,7.49 55.75,20.57 v51.82,24.51
  Bottom 0.305: J1.P$A17 22.1,4.45 24.26,4.45 25.4,5.59 29.59,5.59 v29.59,5.84 | v51.82,24.51 48.9,27.3 v48.39,27.81
DATA5  (via drill 0.5)
  Top 0.305: v46.74,27.81 47.24,27.3 IC5.19 | v29.59,4.57 53.98,4.57 56.52,7.11 56.52,21.08 v51.82,25.78
  Bottom 0.305: J1.P$A18 20.83,4.57 21.72,3.68 24.51,3.68 25.65,4.83 29.59,4.83 v29.59,4.57 | v46.74,27.81 47.75,28.83 48.77,28.83 v51.82,25.78
DGND  (via drill 0.5, 0.7)
  Top 0.305: IC5.12 41.53,26.52 C17.2 v39.5,23.75 | 45.85,11.81 45.85,10.54 C16.2 | 45.85,11.81 IC4.7 | C2.2 26.54,13.97 | v26.54,15.62 27.68,16.76 IC3.7 | IC4.12 IC4.11 52.96,14.73 53.34,14.35 53.34,12.45 52.7,11.81 45.85,11.81 | IC1.12 13.53,25.85 12.19,24.51 C3.2 | C3.2 | 36.7,10.92 IC2.10 | 36.7,10.92 36.83,11.05 | 36.83,11.05 36.83,16.26 36.32,16.76 IC2.1 | C1.2 36.45,10.92 36.7,10.92 | 36.83,11.05 37.72,11.05 v38.1,11.43 | v44.96,11.81 45.85,11.81 | C3.2 v10.29,23.12 v10.29,23.11 10.29,20.57 9.02,19.3 9.02,17.45 C30.- | J1.P$A4 9.4,8 3.94,8 v3.94,5.97 | v7.75,2.92 v11.94,2.92 | IC1.25 22.03,26.61 v22.1,26.54 | IC5.25 52.03,27.73 v52.32,27.43
  Top 0.813: 26.54,13.97 v26.54,15.62
  Bottom 0.305: v3.94,5.97 3.94,4.57 5.59,2.92 v7.75,2.92
  pour Bottom: 7.75,2.41 59.31,2.41 59.31,28.57 7.75,28.57
HWCON  (via drill 0.5)
  Top 0.305: J1.P$A7 13.21,10.54 v19.05,16.38 | v26.92,18.16 32.89,18.16 32.89,16.81 IC3.1
  Bottom 0.305: v19.05,16.38 25.02,16.38 v26.92,18.16
IL1N
  Top 0.813: R2.1 104.65,69.22 107.82,66.04 X1.3
IL1P
  Top 0.813: R1.1 108.46,73.03 X1.1
IL2N
  Top 0.813: R18.1 106.55,50.16 107.19,50.8 X1.9
IL2P
  Top 0.813: R17.1 105.28,53.98 107.19,55.88 X1.7
IL3N
  Top 0.813: R32.1 103.38,31.75 107.19,27.94 X2.3
IL3P
  Top 0.813: R31.1 107.82,35.56 X2.1
IL4N
  Top 0.813: R46.1 X2.9
IL4P
  Top 0.813: R45.1 106.55,16.51 107.82,17.78 X2.7
IR1N
  Top 0.813: R11.1 106.55,59.69 107.82,58.42 X1.6
IR1P
  Top 0.813: R10.1 X1.4
IR2N
  Top 0.813: R25.1 104.65,40.64 107.19,43.18 X1.12
IR2P
  Top 0.813: R24.1 103.38,44.45 107.19,48.26 X1.10
IR3N
  Top 0.813: R39.1 105.92,22.23 107.82,20.32 X2.6
IR3P
  Top 0.813: R38.1 106.55,26.04 107.19,25.4 X2.4
IR4N
  Top 0.813: R53.1 105.92,3.17 107.82,5.08 X2.12
IR4P
  Top 0.813: R52.1 104.01,6.99 107.19,10.16 X2.10
MCLK  (via drill 0.5)
  Top 0.305: IC3.8 29.04,14.9 v28.45,15.49 | IC1.26 22.07,28.19 22.99,28.19 22.99,24.13 24.89,22.23 v28.45,22.23 42.8,22.23 42.93,22.35 42.93,26.42 45.21,28.7 49.28,28.7 49.78,28.19 51.2,28.19 IC5.26 | J1.P$A20 18.29,4.57 19.18,3.68 24.51,3.68 v27.18,6.35
  Bottom 0.305: v28.45,22.23 v28.45,15.49 27.18,14.22 v27.18,6.35
MDI  (via drill 0.5)
  Top 0.305: J1.P$A21 17.02,5.21 15.49,3.68 3.56,3.68 2.16,5.08 0.76,5.08 0.76,23.62 3.94,26.8 9.53,26.8 v12.32,29.59 | v49.02,22.61 49.28,22.86 49.28,25.94 IC5.23 | IC1.23 20.03,26.83 18.54,28.32 v18.54,29.97
  Bottom 0.305: v12.32,29.59 14.1,29.59 14.48,29.97 v18.54,29.97 19.68,29.97 19.94,29.72 39.88,29.72 40.26,30.1 41.53,30.1 v49.02,22.61
MDO  (via drill 0.5)
  Top 0.305: J1.P$A22 15.75,4.95 14.99,4.19 3.81,4.19 2.41,5.59 1.27,5.59 1.27,23.37 4.19,26.29 10.16,26.29 v12.19,28.32 | v49.28,21.08 49.91,21.72 49.91,26.06 IC5.24 | IC1.24 20.53,27.09 20.07,27.56 v20.07,28.32
  Bottom 0.305: v12.19,28.32 14.1,28.32 14.35,28.07 16.26,28.07 16.51,28.32 v20.07,28.32 42.04,28.32 v49.28,21.08
N$1
  Top 0.305: IC2.2 33.64,16.12 33.4,15.88 31.62,15.88 31.62,16.75 IC3.3
N$2
  Top 0.305: IC2.3 33.76,15.47 33.66,15.37 31.37,15.37 30.99,15.75 IC3.4
N$3
  Top 0.305: IC2.4 31.03,14.82 30.35,15.49 30.35,16.75 IC3.5
N$4
  Top 0.305: IC2.5 35.49,14.17 35.43,14.22 30.86,14.22 29.72,15.37 29.72,16.73 IC3.6
N$5
  Top 0.305: IC2.6 31.68,13.52 30.35,12.19 30.35,11.05 30.34,11.03 IC3.10
N$6
  Top 0.305: IC2.7 33.99,12.87 33.91,12.95 31.88,12.95 30.99,12.06 IC3.11
N$7
  Top 0.305: IC2.8 33.88,12.22 33.66,12.45 32.38,12.45 31.62,11.68 31.62,10.94 IC3.12
N$9
  Top 0.305: IC2.9 33.64,11.57 33.4,11.81 32.51,11.81 32.38,11.68 32.38,11.02 IC3.13
N$10
  Top 0.305: IC5.35 53.51,32.73 | 53.51,32.73 C20.1 | 53.51,32.73 54.7,32.73 54.74,32.77 54.74,36.17 C24.+
N$11
  Top 0.305: IC5.47 44.74,37.5 C27.2 43.82,40.24 R9.2
N$12
  Top 0.305: IC4.4 49.15,14.73 50.42,13.46 51.66,13.46 IC4.9
N$13
  Top 0.305: C26.2 R9.1
N$15
  Top 0.813: R11.2 96.5,59.69 R12.2 92.48,60.43 C31.2 91.7,59.69 R14.1
N$16
  Top 0.813: R10.2 95.99,63.5 R12.1 92.48,63.27 C31.1 89.18,63.25 R13.1
N$17
  Top 0.305: IC1.35 22.07,32.77 24.77,32.77 C6.1 25.4,35.94 27.84,35.96 C13.+
N$20
  Top 0.305: IC1.47 15.53,35.02 15.49,35.05 15.49,37.85 14.73,37.85 C15.2 14.48,40.49 R8.2
N$23
  Top 0.813: R2.2 96.5,69.22 R3.2 92.48,69.95 C10.2 91.7,69.22 R5.1
N$24
  Top 0.813: R1.2 95.99,73.03 R3.1 92.48,72.8 C10.1 89.18,72.77 R4.1
N$29
  Top 0.305: C14.2 R8.1
N$30
  Top 0.813: R18.2 96.5,50.16 R19.2 92.48,50.9 C34.2 91.7,50.16 R21.1
N$31
  Top 0.813: R17.2 95.99,53.98 R19.1 92.48,53.75 C34.1 89.18,53.72 R20.1
N$36
  Top 0.813: R25.2 96.5,40.64 R26.2 92.48,41.38 C37.2 91.7,40.64 R28.1
N$37
  Top 0.813: R24.2 95.99,44.45 R26.1 92.48,44.22 C37.1 89.18,44.2 R27.1
N$42
  Top 0.813: R32.2 96.5,31.75 R33.2 92.48,32.49 C40.2 91.7,31.75 R35.1
N$43
  Top 0.813: R31.2 95.99,35.56 R33.1 92.48,35.33 C40.1 89.18,35.31 R34.1
N$48
  Top 0.813: R39.2 96.5,22.23 R40.2 92.48,22.96 C43.2 91.7,22.23 R42.1
N$49
  Top 0.813: R38.2 95.99,26.04 R40.1 92.48,25.81 C43.1 89.18,25.78 R41.1
N$54
  Top 0.813: R46.2 96.5,12.7 R47.2 92.48,13.44 C46.2 91.7,12.7 R49.1
N$55
  Top 0.813: R45.2 95.99,16.51 R47.1 92.48,16.28 C46.1 89.18,16.26 R48.1
N$60
  Top 0.813: R53.2 96.5,3.17 R54.2 92.48,3.91 C49.2 91.7,3.17 R56.1
N$61
  Top 0.813: R52.2 95.99,6.99 R54.1 92.48,6.76 C49.1 89.18,6.73 R55.1
RESET  (via drill 0.5)
  Top 0.305: J1.P$A5 10.67,18.54 13.59,21.46 13.59,24 14.1,24.51 14.1,26.92 14.86,27.69 14.86,28.45 | 14.86,28.45 14.61,28.7 13.56,28.7 IC1.10 | 14.86,28.45 14.86,28.7 v15.24,29.08 | v41.02,29.21 41.4,29.21 41.91,28.7 42.71,28.7 IC5.10
  Bottom 0.305: v15.24,29.08 40.01,29.08 40.13,29.21 v41.02,29.21
SRCLK  (via drill 0.5)
  Top 0.305: J1.P$A8 14.48,7.49 15.11,8.13 v19.94,8.13 | v25.53,8.13 33.53,8.13 34.67,6.99 40.01,6.99 41.53,8.51 IC2.11
  Bottom 0.305: v19.94,8.13 v25.53,8.13